# Altium schematic sheet SY80291A8C 5V-3V3-1V2.SchDoc
size A4
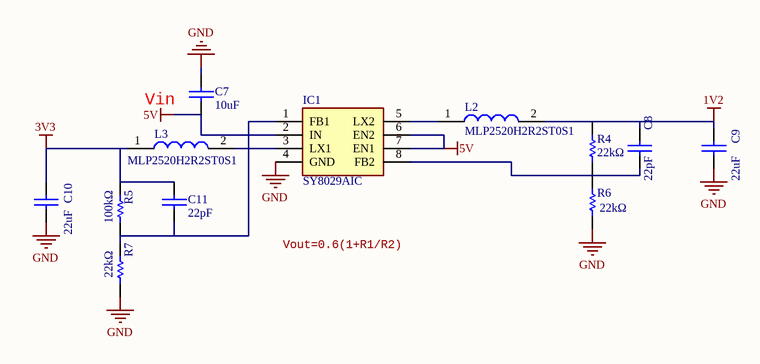
[diagram p0: SY80291A8C 5V-3V3-1V2.SchDoc]

## Parts
C7  10uF  [C_0805]
C8  22pF  [C_0402]
C9  22uF  [C_0603]
C10  22uF  [C_0603]
C11  22pF  [C_0402]
IC1  SY8029AIC  [SOT65P280X110-8N]
L2  MLP2520H2R2ST0S1  [INDC2520X100N]
L3  MLP2520H2R2ST0S1  [INDC2520X100N]
R4  22kΩ  [R_0402]
R5  100kΩ  [R_0402]
R6  22kΩ  [R_0402]
R7  22kΩ  [R_0402]

## Nets
1V2: C8.1 C9.1 L2.2 R4.2
3V3: C10.1 C11.2 L3.1 R5.1
5V: C7.1 IC1.2(IN) IC1.6(EN2) IC1.7(EN1)
GND: C7.2 C9.2 C10.2 IC1.4(GND) R6.1 R7.2
NetC8_2: C8.2 IC1.8(FB2) R4.1 R6.2
NetC11_1: C11.1 IC1.1(FB1) R5.2 R7.1
NetIC1_3: IC1.3(LX1) L3.2
NetIC1_5: IC1.5(LX2) L2.1

## Notes on the sheet
- Vin
- Vout=0.6(1+R1/R2)

## Library data of the parts
C7-C11 = Cap_Chip: 贴片电容; Manufacturer_Name: *; Manufacturer_Part_Number: *
IC1 = SY8029AIC: Integrated Circuit; Manufacturer_Name: Silergy Corp; Manufacturer_Part_Number: SY8029AIC
L2 L3 = MLP2520K1R0MT0S1: Inductor; Manufacturer_Name: TDK; Manufacturer_Part_Number: MLP2520K1R0MT0S1
  L2: Parameter 1: *
R4-R7 = Res_Chip: 贴片电阻; Manufacturer_Name: *; Manufacturer_Part_Number: *